# EasyEDA Pro project ProPrj_line robot _2026-02-24.epro

# Schematic Schematic1
Board Name: Board1; Create Date: 2026-01-24; Page Name: P1; Project Name: line robot; Schematic Name: Schematic1; Update Date: 2026-01-25; Company: EasyEDA.com; Page Size: A4; Version: V1.0
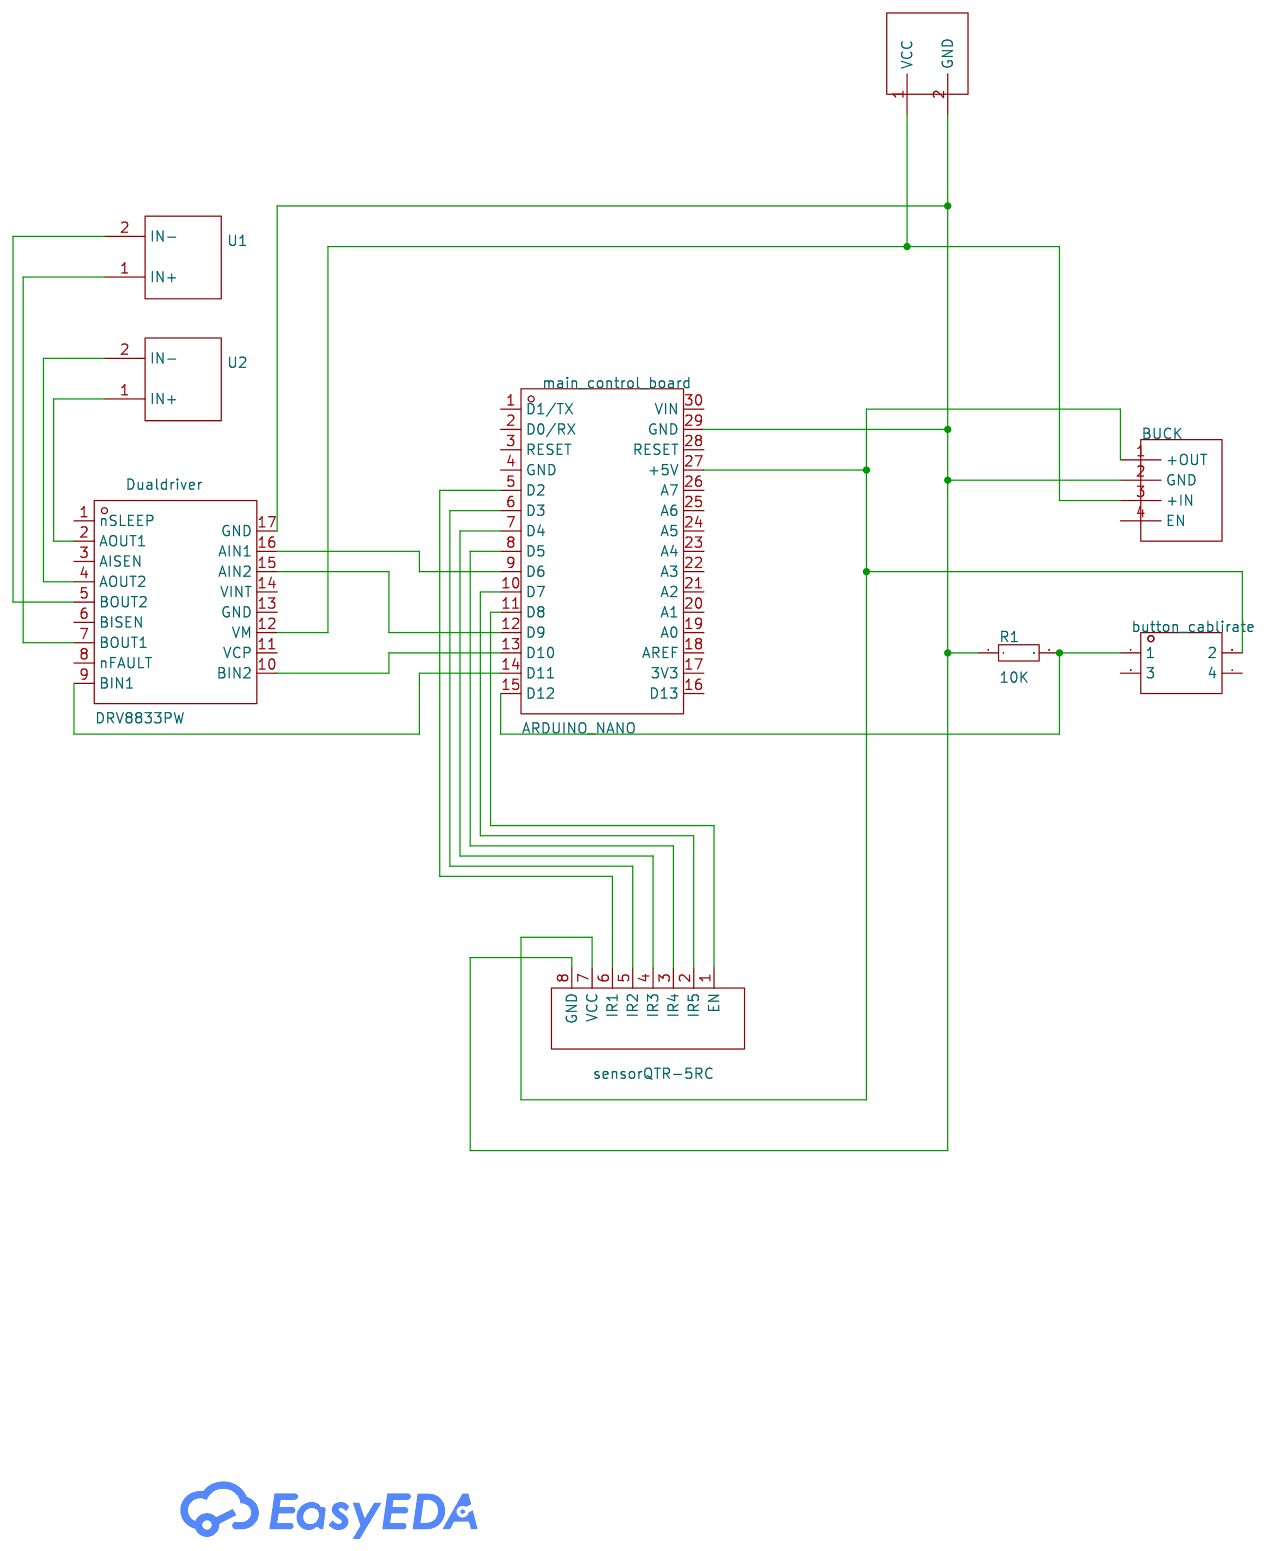
[diagram p0: schematic sheet]

## Parts
BUCK  -
button_cablirate  -  [HDR-TH_4P-P2.54-V-F-R2-C2-S2.54]
Dualdriver  DRV8833PW  [HTSSOP-16_L5.0-W4.4-P0.65-LS6.4-TL-EP-1]
main_control_board  ARDUINO_NANO  [COMM-TH_ARDUINO_NANO]
R1  10K  [R0603]
sensorQTR-5RC  -  [HDR-TH_8P-P2.54-V-F-1]
U1  -
U2  -
U?#1  -

## Library data of the parts
BUCK = BUCK DC-DC 3A
button_cablirate = HDR-F_2.54_2x2: Supplier Footprint: Through
Dualdriver = DRV8833PW: Supplier Part: C9900006077; Supplier Footprint: HTSSOP-16; JLCPCB Part Class: Extended Part; Supplier: LCSC
main_control_board = ARDUINO_NANO: Supplier Part: C9900017879; Supplier Footprint: 插件; JLCPCB Part Class: Extended Part; Supplier: LCSC
R1 = Res_0603: Supplier Footprint: 0603
sensorQTR-5RC = HDR-F_2.54_1x8P: Supplier Footprint: Through
U1 U2 = Geared motor
U?#1 = battery

## Nets
Net-(BUCK-1): BUCK.1(+OUT) button_cablirate.2 main_control_board.27(+5V) sensorQTR-5RC.7(VCC)
Net-(BUCK-2): BUCK.2(GND) Dualdriver.17(GND) main_control_board.29(GND) R1.1 sensorQTR-5RC.8(GND) U?#1.2(GND)
Net-(BUCK-3): BUCK.3(+IN) Dualdriver.12(VM) U?#1.1(VCC)
Net-(button_cablirate-1): button_cablirate.1 main_control_board.15(D12) R1.2
Net-(Dualdriver-2): Dualdriver.2(AOUT1) U2.1(IN+)
Net-(Dualdriver-4): Dualdriver.4(AOUT2) U2.2(IN-)
Net-(Dualdriver-5): Dualdriver.5(BOUT2) U1.2(IN-)
Net-(Dualdriver-7): Dualdriver.7(BOUT1) U1.1(IN+)
Net-(Dualdriver-9): Dualdriver.9(BIN1) main_control_board.14(D11)
Net-(Dualdriver-10): Dualdriver.10(BIN2) main_control_board.13(D10)
Net-(Dualdriver-15): Dualdriver.15(AIN2) main_control_board.12(D9)
Net-(Dualdriver-16): Dualdriver.16(AIN1) main_control_board.9(D6)
Net-(main_control_board-5): main_control_board.5(D2) sensorQTR-5RC.6(IR1)
Net-(main_control_board-6): main_control_board.6(D3) sensorQTR-5RC.5(IR2)
Net-(main_control_board-7): main_control_board.7(D4) sensorQTR-5RC.4(IR3)
Net-(main_control_board-8): main_control_board.8(D5) sensorQTR-5RC.3(IR4)
Net-(main_control_board-10): main_control_board.10(D7) sensorQTR-5RC.2(IR5)
Net-(main_control_board-11): main_control_board.11(D8) sensorQTR-5RC.1(EN)

Not connected (* = marked no-connect by the designer): BUCK 4(EN); button_cablirate 3 4; Dualdriver 1(nSLEEP) 3(AISEN) 6(BISEN) 8(nFAULT) 11(VCP) 13(GND) 14(VINT); main_control_board 1(D1/TX) 2(D0/RX) 3(RESET) 4(GND) 16(D13) 17(3V3) 18(AREF) 19(A0) 20(A1) 21(A2) 22(A3) 23(A4) 24(A5) 25(A6) 26(A7) 28(RESET) 30(VIN)
